# Altium project 6502.PrjPcb
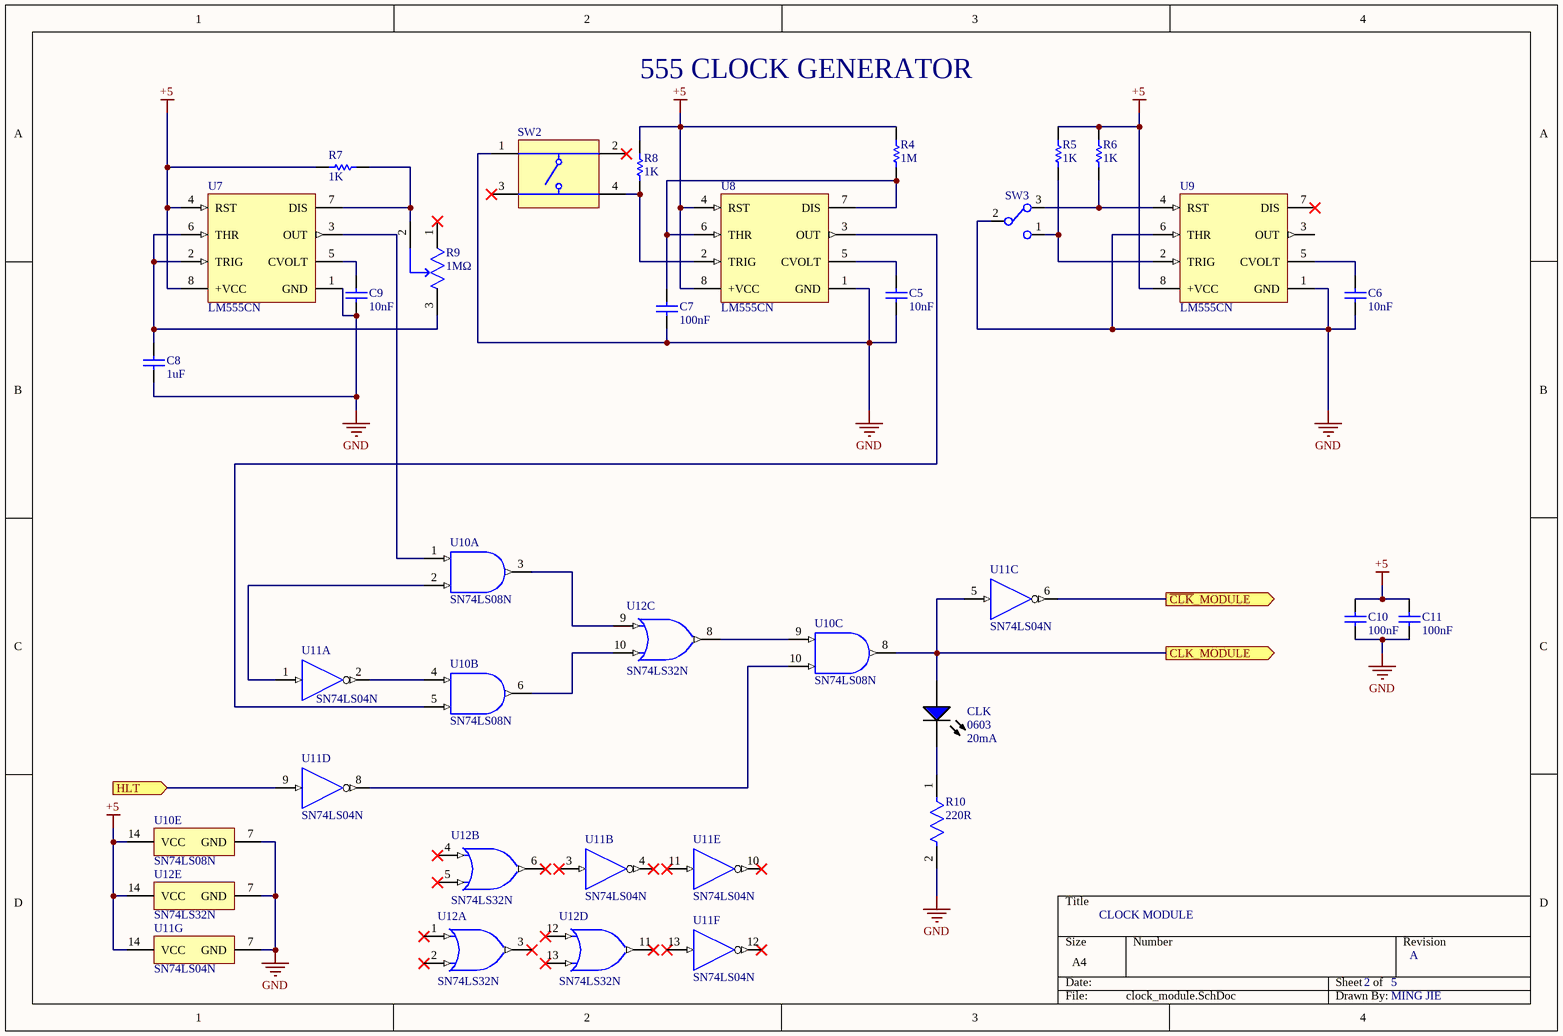
[diagram p0: clock_module.SchDoc]
3 sheets, 91 parts. Net scope: global (net labels, ports and power ports of the same name join across sheets).
Board file: 6502_carrier.PcbDoc
Sheets:
  clock_module.SchDoc
  address_LEDs.SchDoc
  ps2_interface.SchDoc

## Sheet clock_module.SchDoc
size A4; SheetNumber: 2; SheetTotal: 5

### Parts
C5  Capacitance: 10nF  [CAPC2013X70X45ML10T25]  (hidden comment: GRM216R71H103KA01D)
C6  Capacitance: 10nF  [CAPC2013X70X45ML10T25]  (hidden comment: GRM216R71H103KA01D)
C7  Capacitance: 100nF  [CAPC2013X135X45ML10T25]  (hidden comment: GRM21BR71H104KA01L)
C8  Capacitance: 1uF  [CAPC2013X70X45NL10T25]  (hidden comment: GRM216R61E105KA12D)
C9  Capacitance: 10nF  [CAPC2013X70X45ML10T25]  (hidden comment: GRM216R71H103KA01D)
C10  Capacitance: 100nF  [CAPC2013X135X45ML10T25]  (hidden comment: GRM21BR71H104KA01L)
C11  Capacitance: 100nF  [CAPC2013X135X45ML10T25]  (hidden comment: GRM21BR71H104KA01L)
CLK  Package Reference: 0603  Test Current: 20mA  [EVRL-0603-2_V]  (hidden comment: 19-217/BHC-ZL1M2RY/3T)
R4  Resistance: 1M  [RESC2013X50X30NL20T20]  (hidden comment: CRCW08051M00JNEA)
R5  Resistance: 1K  [RESC2013X50X30NL20T20]  (hidden comment: CRCW08051K00FKEA)
R6  Resistance: 1K  [RESC2013X50X30NL20T20]  (hidden comment: CRCW08051K00FKEA)
R7  Resistance: 1K  [RESC2013X50X30NL20T20]  (hidden comment: CRCW08051K00FKEA)
R8  Resistance: 1K  [RESC2013X50X30NL20T20]  (hidden comment: CRCW08051K00FKEA)
R9  Resistance: 1MΩ  [FP-3296W-MFG]  (hidden comment: 3296W-1-105LF)
R10  Resistance: 220R  [FP-CRCW0805-e3-MFG]  (hidden comment: CRCW0805220RFKEA)
SW2  K2-1102SP-C4SC-04  [TECO-FSM4JSMA_V]  (value not drawn)
SW3  SS-12D02-VG4  [5_2-54mm_SPDT]  (value not drawn)
U7  LM555CN  [N08E]
U8  LM555CN  [N08E]
U9  LM555CN  [N08E]
U10  SN74LS08N  [N0014A]  (parts A,B,C,E of 5)
U11  SN74LS04N  [N0014A]  (parts A,B,C,D,E,F,G of 7)
U12  SN74LS32N  [N0014A]  (parts A,B,C,D,E of 5)

### Ports
CLK_MODULE (out), HLT (in), ~{CLK}_MODULE (out)

### Nets
+5: C10.1 C11.1 R4.1 R5.2 R6.2 R7.1 R8.2 U7.4(RST) U7.8(+VCC) U8.4(RST) U8.8(+VCC) U9.8(+VCC) U10.14(VCC) U11.14(VCC) U12.14(VCC)
GND: C5.1 C6.1 C7.2 C8.2 C9.1 C10.2 C11.2 R10.2 SW2.1 SW3.2 U7.1(GND) U8.1(GND) U9.1(GND) U9.6(THR) U10.7(GND) U11.7(GND) U12.7(GND)
NetC5_2: C5.2 U8.5(CVOLT)
NetC6_2: C6.2 U9.5(CVOLT)
NetC7_1: C7.1 R4.2 U8.6(THR) U8.7(DIS)
NetC8_1: C8.1 R9.3(CW) U7.2(TRIG) U7.6(THR)
NetC9_2: C9.2 U7.5(CVOLT)
NetCLK_1: CLK.1(A) U10.8(3Y) U11.5(3A) ; port CLK_MODULE
NetCLK_2: CLK.2(K) R10.1
NetR5_1: R5.1 SW3.1 U9.2(TRIG)
NetR6_1: R6.1 SW3.3 U9.4(RST)
NetR7_2: R7.2 R9.2(WIPER) U7.7(DIS)
NetR8_1: R8.1 SW2.4 U8.2(TRIG)
NetU7_3: U7.3(OUT) U10.1(1A)
NetU8_3: U8.3(OUT) U10.5(2B)
NetU10_2: U10.2(1B) U11.1(1A)
NetU10_3: U10.3(1Y) U12.9(3A)
NetU10_4: U10.4(2A) U11.2(~{1Y})
NetU10_6: U10.6(2Y) U12.10(3B)
NetU10_9: U10.9(3A) U12.8(3Y)
NetU10_10: U10.10(3B) U11.8(~{4Y})
NetU11_6: U11.6(~{3Y}) ; port ~{CLK}_MODULE
NetU11_9: U11.9(4A) ; port HLT

Not connected (* = marked no-connect by the designer): R9 1(CCW)*; SW2 2* 3*; U9 3(OUT) 7(DIS)*; U11 3(2A)* 4(~{2Y})* 10(~{5Y})* 11(5A)* 12(~{6Y})* 13(6A)*; U12 1(1A)* 2(1B)* 3(1Y)* 4(2A)* 5(2B)* 6(2Y)* 11(4Y)* 12(4A)* 13(4B)*

### Notes on the sheet
- 555 CLOCK GENERATOR
- CLOCK MODULE
- 2
- 5
- A
- MING JIE

### Library data of the parts
C5 C6 C9 = CMP-2000-05013-1: Chip Capacitor, 10 nF, +/- 10%, 50 V, -55 to 125 degC, 0805 (2012 Metric), RoHS, Tape and Reel; Manufacturer: Murata; Voltage Rating DC: 50V; Temperature Coefficient / Code: +/-15%; Capacitance - pF: 10000pF; Case Height: 0.6mm; Dielectric: X7R; Case Length: 2mm; Case Width: 1.25mm; Type: GeneralPurposeMLCC; Brand: MurataElectronics; Tolerance: 10%; Product Category: MultilayerCeramicCapacitorsMLCC-SMD/SMT; Minimum Operating Temperature: -55C; Voltage Rating: 50V; Series: GRM; Packaging: Reel; Dimensions: 1.25mmWx2mmLx0.6mmH; Operating Temperature Range: -55Cto+125C; Package / Case: 0805(2012metric); Datasheet URL: https://datasheet.ciiva.com/29201/452521-da-01-en-vs-kondensator-0805-29201121.pdf; Maximum Operating Temperature: +125C; Factory Pack Quantity: 4000; Case Code - in: 0805; Case Code - mm: 2012; Manufacturer URL: http://www.murata.com/; Termination Style: SMD/SMT; Datasheet Version: Dec-10; RoHS: Details; Product: GeneralTypeMLCCs; Capacitance - nF: 10nF
C7 C10 C11 = CMP-2100-03644-1: Chip Capacitor, 0.1 uF, +/- 10%, 50 V, -55 to 125 degC, 0805 (2012 Metric), RoHS, Tape and Reel; Manufacturer: Murata; Voltage: 50V; Insulation Resistance: 10GR; Dielectric Material: Ceramic; Dielectric: X7R; Package Description: 2-Pin Surface Mount Device, Body 2 x 1.25 mm; Manufacturer URL: http://www.murata.com/; Case Code (Imperial): 0805; Datasheet URL: http://psearch.en.murata.com/capacitor/product/GRM21BR71H104KA01%23.pdf; Termination: SMD/SMT; Lead Free: LeadFree; Package Quantity: 1; Mount: SurfaceMount; REACH SVHC: Unknown; Thickness: 0.053inch; Height: 1.25mm; Case/Package: 0805; Voltage Rating: 50V; Width: 0.049inch; Case Code (Metric): 2012; Material: Ceramic; Min Operating Temperature: -55degC; RoHSCompliant: true; Datasheet Version: 42675.0; Voltage Rating (DC): 50V; Tolerance: 10%; Package Reference: 0805; Depth: 1.25mm; Length: 2mm; Max Operating Temperature: 125degC; Packaging: TapeandReel; Number of Pins: 2; Radiation Hardening: No
C8 = CMP-2007-00957-1: Manufacturer: Murata; Part Number: GRM216R61E105KA12D
CLK = CMP-2100-03577-1: Chip LED, Blue, 5 V, 25 mA, -40 to 85 degC, 2-Pin SMD (0603), RoHS, Tape and Reel; Manufacturer: Everlight Electronics; Number of LEDs: 1; Luminous Intensity: 28.5mcd; Lens Style: Rectangular; Forward Current: 25mA; Power Dissipation: 110W; Forward Voltage: 3V; Viewing Angle: 120degrees; Dominant Wavelength: 470nm; Max Operating Temperature: 85degC; Mount: SurfaceMount; Package Description: 2-Pin Surface Mount Device, Body 1.6 x 0.8 mm; Depth: 0.8mm; Packaging: TapeandReel; Length: 1.6mm; Radiation Hardening: No; Colour: Blue; Datasheet Version: Rev. 1.0, 03/2003; Min Operating Temperature: -40degC; Number of Elements: 1; Manufacturer URL: http://www.everlight.com/; Datasheet URL: https://datasheet.ciiva.com/26901/getdatasheetpartid-420616-26901324.pdf; Case/Package: SMD/SMT; Lead Free: LeadFree; RoHSCompliant: true; Number of Pins: 2
R4 = CMP-2001-03632-1: Manufacturer: Vishay Dale; Part Number: CRCW08051M00JNEA
R5-R8 = CMP-1013-00510-2: Manufacturer: Vishay Dale; Part Number: CRCW08051K00FKEA
R9 = CMP-2000-05583-2: TRIMMER 1M OHM 0.5W PC PIN TOP; Manufacturer: Bourns; Manufacturer Part Number: 3296W-1-504LF; Temperature Coefficient: 100ppm/°C; Value: 1MΩ; Tolerance: 10%; Voltage Rating: 300V; Standoff Height: 0.38mm; ComponentLink2Description: Datasheet; Package: 3296W; Series: Trimpot 3296-Sealed; Lead Free: Yes; Octopart: https://octopart.com/3296w-1-504lf-bourns-143884; Device Class L2: Resistors; Automotive: No; RoHS: TRUE; Temperature Range High: +125°C; Height: 12.05mm; Power Rating: 0.5W; Temperature Range Low: -55°C; ComponentLink2URL: https://www.bourns.com/docs/Product-Datasheets/3296.pdf; Device Class L1: Passive Components; Device Class L3: Variable Resistors and Potentiometers; Category: Res; Temperature: -55°C to +125°C; Digikey Description: TRIMMER 500K OHM 0.5W PC PIN TOP; Mouser Description: Trimmer; Cermet; Rest 500 Kilohms; PCB; 25 Turns; Pwr-Rtg 0.5W
R10 = CMP-2001-03682-2: RES Thick Film, 220Ω, 1%, 0.125W, 100ppm/°C, 0805; Max Power Dissipation: 125mW; Voltage Rating: 150V; Packaging: Tape and Reel; Termination: SMD/SMT; Height: 0.45mm; Package Quantity: 10; Width: 0.049inch; Min Operating Temperature: -55°C; Lead Free: Lead Free; Military Standard: Not; Mount: Surface Mount; Max Operating Temperature: 155°C; Voltage Rating (DC): 150V; Composition: Thick Film; Case/Package: 0805; Length: 2mm; Weight: 0.000194oz; Case Code (Metric): 2012; Number of Terminations: 2; Case Code (Imperial): 0805; Radiation Hardening: No; Tolerance: 1%; Features: Automotive AEC-Q200; Power Rating: 125mW; Depth: 1.25mm; Contact Plating: Tin; Temperature Coefficient: 100ppm/°C
SW2 = CMP-2000-05602-2: Swicth, SPST, 24 V, -35 to 85 degC, 4-Pin SMD, RoHS, Tape and Reel; Manufacturer: TE Connectivity; Switch Travel: 0.25mm; Mechanical Life: 100000Cycles; Contact Current Rating: 50mA; Operating Force: 1.57N; Actuator Material: Polyamide; Contact Resistance: 100mOhm; Voltage Rating: 24V; Illumination Type: Illuminated; Actuator Length: 0.055inch; Max Voltage Rating (DC): 12V; Case\/Package: SMD/SMT; Orientation: Straight; Datasheet URL: http://www.te.com/commerce/DocumentDelivery/DDEController?Action=showdoc&DocId=Customer+Drawing%7F2-1437565-7%7FV%7Fpdf%7FEnglish%7FENG_CD_2-1437565-7_V.pdf%7F4-1437565-2; Min Operating Temperature: -35degC; Packaging: LoosePiece; Termination: GullWing; Throw Configuration: SPST; Package Description: 4-Pin Surface Mount Device, Body 6 x 6 mm, Pitch 4.5 mm; Mounting Technology: SurfaceMount; Contact Plating: Silver; Datasheet Version: Rev. V, 02/2015; RoHSCompliant: true; Max Operating Temperature: 85degC; Length: 6mm; Voltage Rating (DC): 24V; Electrical Life: 100000Cycles; Current Rating: 50mA; Package Quantity: 750; Mount: SurfaceMount; Package Reference: FSM4JSMA; Manufacturer URL: http://www.te.com/; Width: 6mm; REACH SVHC: Unknown; Contact Material: CopperAlloy
SW3 = SS-12D02-VG4: SPDT, Korean Hroparts Elec SS-12D02-VG4
U7-U9 = CMP-0056-00017-2: Timer, 8-pin MDIP; Manufacturer: National Semiconductor; CompType: Analog IC; PackageTopMarking: NSUZXYTTE#*LM*555CN; PowerWise: N; PackageReference: N08E; ComponentLink1Description: LM555 Datasheet; ComponentLink3URL: http://www.national.com/packaging/folders/n08e.html; ComponentLink1URL: http://www.national.com/ds/LM/LM555.pdf; ComponentLink2URL: http://www.national.com/pf/LM/LM555.html; PackageDescription: MDIP, .365 x .250 x .130in, 8 Lead, .100in Pitch; DatasheetVersion: Jul-2006; RevisionNote: Component URLs added; Code_JEDEC: MS-001-BA; PinCount: 8; ComponentLink3Description: N08E Package Page; PackageVersion: revG, May-2006; ComponentLink2Description: LM555 Web Page; RoHS: N
U10 = CMP-0777-00259-3: Quadruple 2-Input Positive-AND Gates, N0014A, TUBE; Manufacturer: Texas Instruments; VCC(Max)(V): 5.25; ICC @ Nom Voltage(Max)(mA): 0.021; VCC(Min)(V): 4.75; tpd @ Nom Voltage(Max)(ns): 25; Rating: Catalog; Output Type: TTL; Bits(#): 4; Schmitt Trigger: No; Voltage(Nom)(V): 5; Technology Family: LS; F @ Nom Voltage(Max)(Mhz): 35; Output Drive (IOL/IOH)(Max)(mA): -0.8/16; PackageReference: N0014A; DatasheetVersion: SDLS033; Input Type: TTL; Operating Temperature Range(C): 0 to 70; Generic Part Number: SN74LS08
U11 = CMP-1615-00911-2: Hex inverters, N0014A, TUBE; Manufacturer: Texas Instruments; Output Drive (IOL/IOH)(Max)(mA): -0.4/8; Schmitt Trigger: No; F @ Nom Voltage(Max)(Mhz): 35; Voltage(Nom)(V): 5; Technology Family: LS; Input Type: TTL; Output Type: CMOS; Bits(#): 6; VCC(Max)(V): 5.25; ICC @ Nom Voltage(Max)(mA): 0.033; Rating: Catalog; VCC(Min)(V): 4.75; tpd @ Nom Voltage(Max)(ns): 22; Operating Temperature Range(C): 0 to 70; DatasheetVersion: SDLS029C; Generic Part Number: SN74LS04; Code_JEDEC: MS-001; PackageReference: N0014A
U12 = CMP-1573-00145-3: Quad 2-input positive-OR gates, N0014A, TUBE; Manufacturer: Texas Instruments; tpd @ Nom Voltage(Max)(ns): 22; Output Drive (IOL/IOH)(Max)(mA): 0.8/-16; Input Type: TTL; VCC(Min)(V): 4.75; F @ Nom Voltage(Max)(Mhz): 35; Voltage(Nom)(V): 5; ICC @ Nom Voltage(Max)(mA): 0.038; VCC(Max)(V): 5.25; Rating: Catalog; Bits(#): 4; Generic Part Number: SN74LS32; DatasheetVersion: SDLS100; Operating Temperature Range(C): 0 to 70; Output Type: TTL; Code_JEDEC: MS-001; PackageVersion: http://www.ti.com/lit/ml/mpdi002c/mpdi002c.pdf; PackageReference: N0014A

## Sheet address_LEDs.SchDoc
size A4; SheetNumber: 3; SheetTotal: 5
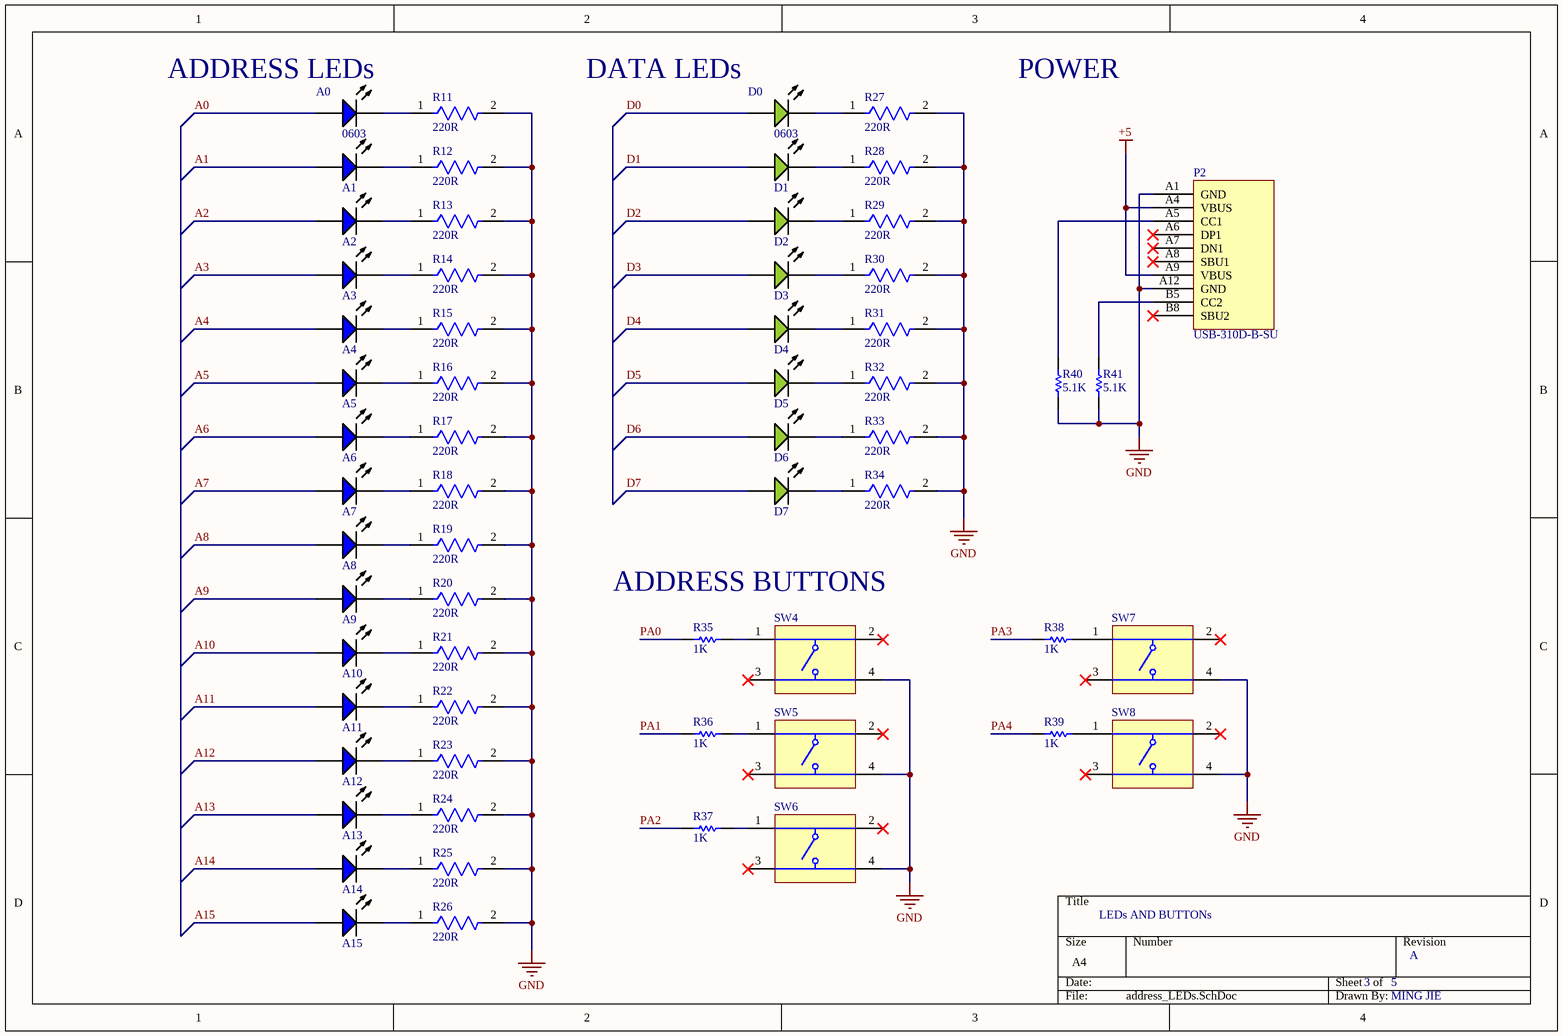
[diagram p1: address_LEDs.SchDoc]

### Parts
A0  Package Reference: 0603  [EVRL-0603-2_V]  (hidden comment: 19-217/BHC-ZL1M2RY/3T)
A1  19-217/BHC-ZL1M2RY/3T  [EVRL-0603-2_V]  (value not drawn)
A2  19-217/BHC-ZL1M2RY/3T  [EVRL-0603-2_V]  (value not drawn)
A3  19-217/BHC-ZL1M2RY/3T  [EVRL-0603-2_V]  (value not drawn)
A4  19-217/BHC-ZL1M2RY/3T  [EVRL-0603-2_V]  (value not drawn)
A5  19-217/BHC-ZL1M2RY/3T  [EVRL-0603-2_V]  (value not drawn)
A6  19-217/BHC-ZL1M2RY/3T  [EVRL-0603-2_V]  (value not drawn)
A7  19-217/BHC-ZL1M2RY/3T  [EVRL-0603-2_V]  (value not drawn)
A8  19-217/BHC-ZL1M2RY/3T  [EVRL-0603-2_V]  (value not drawn)
A9  19-217/BHC-ZL1M2RY/3T  [EVRL-0603-2_V]  (value not drawn)
A10  19-217/BHC-ZL1M2RY/3T  [EVRL-0603-2_V]  (value not drawn)
A11  19-217/BHC-ZL1M2RY/3T  [EVRL-0603-2_V]  (value not drawn)
A12  19-217/BHC-ZL1M2RY/3T  [EVRL-0603-2_V]  (value not drawn)
A13  19-217/BHC-ZL1M2RY/3T  [EVRL-0603-2_V]  (value not drawn)
A14  19-217/BHC-ZL1M2RY/3T  [EVRL-0603-2_V]  (value not drawn)
A15  19-217/BHC-ZL1M2RY/3T  [EVRL-0603-2_V]  (value not drawn)
D0  Package Reference: 0603  [EVRL-0603-2_V]  (hidden comment: 19-217/GHC-YR1S2/3T)
D1  19-217/GHC-YR1S2/3T  [EVRL-0603-2_V]  (value not drawn)
D2  19-217/GHC-YR1S2/3T  [EVRL-0603-2_V]  (value not drawn)
D3  19-217/GHC-YR1S2/3T  [EVRL-0603-2_V]  (value not drawn)
D4  19-217/GHC-YR1S2/3T  [EVRL-0603-2_V]  (value not drawn)
D5  19-217/GHC-YR1S2/3T  [EVRL-0603-2_V]  (value not drawn)
D6  19-217/GHC-YR1S2/3T  [EVRL-0603-2_V]  (value not drawn)
D7  19-217/GHC-YR1S2/3T  [EVRL-0603-2_V]  (value not drawn)
P2  USB-310D-B-SU  [USB-C-THT]
R11  Resistance: 220R  [FP-CRCW0805-e3-MFG]  (hidden comment: CRCW0805220RFKEA)
R12  Resistance: 220R  [FP-CRCW0805-e3-MFG]  (hidden comment: CRCW0805220RFKEA)
R13  Resistance: 220R  [FP-CRCW0805-e3-MFG]  (hidden comment: CRCW0805220RFKEA)
R14  Resistance: 220R  [FP-CRCW0805-e3-MFG]  (hidden comment: CRCW0805220RFKEA)
R15  Resistance: 220R  [FP-CRCW0805-e3-MFG]  (hidden comment: CRCW0805220RFKEA)
R16  Resistance: 220R  [FP-CRCW0805-e3-MFG]  (hidden comment: CRCW0805220RFKEA)
R17  Resistance: 220R  [FP-CRCW0805-e3-MFG]  (hidden comment: CRCW0805220RFKEA)
R18  Resistance: 220R  [FP-CRCW0805-e3-MFG]  (hidden comment: CRCW0805220RFKEA)
R19  Resistance: 220R  [FP-CRCW0805-e3-MFG]  (hidden comment: CRCW0805220RFKEA)
R20  Resistance: 220R  [FP-CRCW0805-e3-MFG]  (hidden comment: CRCW0805220RFKEA)
R21  Resistance: 220R  [FP-CRCW0805-e3-MFG]  (hidden comment: CRCW0805220RFKEA)
R22  Resistance: 220R  [FP-CRCW0805-e3-MFG]  (hidden comment: CRCW0805220RFKEA)
R23  Resistance: 220R  [FP-CRCW0805-e3-MFG]  (hidden comment: CRCW0805220RFKEA)
R24  Resistance: 220R  [FP-CRCW0805-e3-MFG]  (hidden comment: CRCW0805220RFKEA)
R25  Resistance: 220R  [FP-CRCW0805-e3-MFG]  (hidden comment: CRCW0805220RFKEA)
R26  Resistance: 220R  [FP-CRCW0805-e3-MFG]  (hidden comment: CRCW0805220RFKEA)
R27  Resistance: 220R  [FP-CRCW0805-e3-MFG]  (hidden comment: CRCW0805220RFKEA)
R28  Resistance: 220R  [FP-CRCW0805-e3-MFG]  (hidden comment: CRCW0805220RFKEA)
R29  Resistance: 220R  [FP-CRCW0805-e3-MFG]  (hidden comment: CRCW0805220RFKEA)
R30  Resistance: 220R  [FP-CRCW0805-e3-MFG]  (hidden comment: CRCW0805220RFKEA)
R31  Resistance: 220R  [FP-CRCW0805-e3-MFG]  (hidden comment: CRCW0805220RFKEA)
R32  Resistance: 220R  [FP-CRCW0805-e3-MFG]  (hidden comment: CRCW0805220RFKEA)
R33  Resistance: 220R  [FP-CRCW0805-e3-MFG]  (hidden comment: CRCW0805220RFKEA)
R34  Resistance: 220R  [FP-CRCW0805-e3-MFG]  (hidden comment: CRCW0805220RFKEA)
R35  Resistance: 1K  [RESC2013X50X30NL20T20]  (hidden comment: CRCW08051K00FKEA)
R36  Resistance: 1K  [RESC2013X50X30NL20T20]  (hidden comment: CRCW08051K00FKEA)
R37  Resistance: 1K  [RESC2013X50X30NL20T20]  (hidden comment: CRCW08051K00FKEA)
R38  Resistance: 1K  [RESC2013X50X30NL20T20]  (hidden comment: CRCW08051K00FKEA)
R39  Resistance: 1K  [RESC2013X50X30NL20T20]  (hidden comment: CRCW08051K00FKEA)
R40  Resistance: 5.1K  [RESC2013X50X30NL20T20]  (hidden comment: 0805W8F5101T5E)
R41  Resistance: 5.1K  [RESC2013X50X30NL20T20]  (hidden comment: 0805W8F5101T5E)
SW4  K2-1102SP-C4SC-04  [TECO-FSM4JSMA_V]  (value not drawn)
SW5  K2-1102SP-C4SC-04  [TECO-FSM4JSMA_V]  (value not drawn)
SW6  K2-1102SP-C4SC-04  [TECO-FSM4JSMA_V]  (value not drawn)
SW7  K2-1102SP-C4SC-04  [TECO-FSM4JSMA_V]  (value not drawn)
SW8  K2-1102SP-C4SC-04  [TECO-FSM4JSMA_V]  (value not drawn)

### Nets
+5: P2.A4(VBUS) P2.A9(VBUS)
GND: P2.A1(GND) P2.A12(GND) R11.2 R12.2 R13.2 R14.2 R15.2 R16.2 R17.2 R18.2 R19.2 R20.2 R21.2 R22.2 R23.2 R24.2 R25.2 R26.2 R27.2 R28.2 R29.2 R30.2 R31.2 R32.2 R33.2 R34.2 R40.1 R41.1 SW4.4 SW5.4 SW6.4 SW7.4 SW8.4
A0: A0.1(A)
A1: A1.1(A)
A2: A2.1(A)
A3: A3.1(A)
A4: A4.1(A)
A5: A5.1(A)
A6: A6.1(A)
A7: A7.1(A)
A8: A8.1(A)
A9: A9.1(A)
A10: A10.1(A)
A11: A11.1(A)
A12: A12.1(A)
A13: A13.1(A)
A14: A14.1(A)
A15: A15.1(A)
D0: D0.1(A)
D1: D1.1(A)
D2: D2.1(A)
D3: D3.1(A)
D4: D4.1(A)
D5: D5.1(A)
D6: D6.1(A)
D7: D7.1(A)
PA0: R35.1
PA1: R36.1
PA2: R37.1
PA3: R38.1
PA4: R39.1
NetA0_2: A0.2(K) R11.1
NetA1_2: A1.2(K) R12.1
NetA2_2: A2.2(K) R13.1
NetA3_2: A3.2(K) R14.1
NetA4_2: A4.2(K) R15.1
NetA5_2: A5.2(K) R16.1
NetA6_2: A6.2(K) R17.1
NetA7_2: A7.2(K) R18.1
NetA8_2: A8.2(K) R19.1
NetA9_2: A9.2(K) R20.1
NetA10_2: A10.2(K) R21.1
NetA11_2: A11.2(K) R22.1
NetA12_2: A12.2(K) R23.1
NetA13_2: A13.2(K) R24.1
NetA14_2: A14.2(K) R25.1
NetA15_2: A15.2(K) R26.1
NetD0_2: D0.2(K) R27.1
NetD1_2: D1.2(K) R28.1
NetD2_2: D2.2(K) R29.1
NetD3_2: D3.2(K) R30.1
NetD4_2: D4.2(K) R31.1
NetD5_2: D5.2(K) R32.1
NetD6_2: D6.2(K) R33.1
NetD7_2: D7.2(K) R34.1
NetP2_A5: P2.A5(CC1) R40.2
NetP2_B5: P2.B5(CC2) R41.2
NetR35_2: R35.2 SW4.1
NetR36_2: R36.2 SW5.1
NetR37_2: R37.2 SW6.1
NetR38_2: R38.2 SW7.1
NetR39_2: R39.2 SW8.1

Not connected (* = marked no-connect by the designer): P2 A6(DP1)* A7(DN1)* A8(SBU1)* B8(SBU2)*; SW4 2* 3*; SW5 2* 3*; SW6 2* 3*; SW7 2* 3*; SW8 2* 3*

### Notes on the sheet
- (near A0) ADDRESS LEDs
- DATA LEDs
- POWER
- ADDRESS BUTTONS
- LEDs AND BUTTONs
- 3
- 5
- A
- MING JIE

### Library data of the parts
A0-A15 = CMP-2100-03577-1: Chip LED, Blue, 5 V, 25 mA, -40 to 85 degC, 2-Pin SMD (0603), RoHS, Tape and Reel; Manufacturer: Everlight Electronics; Test Current: 20mA; Number of LEDs: 1; Luminous Intensity: 28.5mcd; Lens Style: Rectangular; Forward Current: 25mA; Power Dissipation: 110W; Forward Voltage: 3V; Viewing Angle: 120degrees; Dominant Wavelength: 470nm; Max Operating Temperature: 85degC; Mount: SurfaceMount; Package Description: 2-Pin Surface Mount Device, Body 1.6 x 0.8 mm; Depth: 0.8mm; Packaging: TapeandReel; Length: 1.6mm; Radiation Hardening: No; Colour: Blue; Datasheet Version: Rev. 1.0, 03/2003; Min Operating Temperature: -40degC; Number of Elements: 1; Manufacturer URL: http://www.everlight.com/; Datasheet URL: https://datasheet.ciiva.com/26901/getdatasheetpartid-420616-26901324.pdf; Case/Package: SMD/SMT; Lead Free: LeadFree; RoHSCompliant: true; Number of Pins: 2
  A1-A15: Package Reference: 0603
D0-D7 = CMP-2100-03580-1: Green 520~535nm 0603 Light Emitting Diodes (LED) RoHS; Manufacturer: Everlight Electronics; Lens Style: Rectangular; Forward Voltage: 2V; Number of LEDs: 1; Viewing Angle: 120degrees; Colour: Green; RoHSCompliant: true; Datasheet URL: https://datasheet.ciiva.com/48679/19-217-g7c-an1p2-3t-48679179.pdf; Manufacturer URL: http://www.everlight.com/; Package Description: 2-Pin Surface Mount Device, Body 1.6 x 0.8 mm; Datasheet Version: Rev. 1, 04/2006; Mount: SurfaceMount; Lead Free: LeadFree; Number of Pins: 2
  D1-D7: Package Reference: 0603
P2 = USB-310D-B-SU: USB Type C Receptacle
R11-R34 = CMP-2001-03682-2: as R10 on sheet clock_module; Packaging: Tape and Reel; Termination: SMD/SMT; Height: 0.45mm; Package Quantity: 10; Width: 0.049inch; Min Operating Temperature: -55°C; Lead Free: Lead Free; Military Standard: Not; Mount: Surface Mount; Max Operating Temperature: 155°C; Voltage Rating (DC): 150V; Composition: Thick Film; Case/Package: 0805; Length: 2mm; Weight: 0.000194oz; Case Code (Metric): 2012; Number of Terminations: 2; Case Code (Imperial): 0805; Radiation Hardening: No; Tolerance: 1%; Features: Automotive AEC-Q200; Power Rating: 125mW; Depth: 1.25mm; Contact Plating: Tin; Temperature Coefficient: 100ppm/°C
R35-R39 = CMP-1013-00510-2: Manufacturer: Vishay Dale; Part Number: CRCW08051K00FKEA
R40 R41 = CMP-1013-00510-2: 5.1kΩ ±1% 0.125W ±100ppm/℃ 0805 Chip Resistor - Surface Mount RoHS; Manufacturer: UniOhm; Part Number: 0805W8F5101T5E
SW4-SW8 = CMP-2000-05602-2: as SW2 on sheet clock_module; Orientation: Straight; Datasheet URL: http://www.te.com/commerce/DocumentDelivery/DDEController?Action=showdoc&DocId=Customer+Drawing%7F2-1437565-7%7FV%7Fpdf%7FEnglish%7FENG_CD_2-1437565-7_V.pdf%7F4-1437565-2; Min Operating Temperature: -35degC; Packaging: LoosePiece; Termination: GullWing; Throw Configuration: SPST; Package Description: 4-Pin Surface Mount Device, Body 6 x 6 mm, Pitch 4.5 mm; Mounting Technology: SurfaceMount; Contact Plating: Silver; Datasheet Version: Rev. V, 02/2015; RoHSCompliant: true; Max Operating Temperature: 85degC; Length: 6mm; Voltage Rating (DC): 24V; Electrical Life: 100000Cycles; Current Rating: 50mA; Package Quantity: 750; Mount: SurfaceMount; Package Reference: FSM4JSMA; Manufacturer URL: http://www.te.com/; Width: 6mm; REACH SVHC: Unknown; Contact Material: CopperAlloy

## Sheet ps2_interface.SchDoc
size A4; SheetNumber: 5; SheetTotal: 5
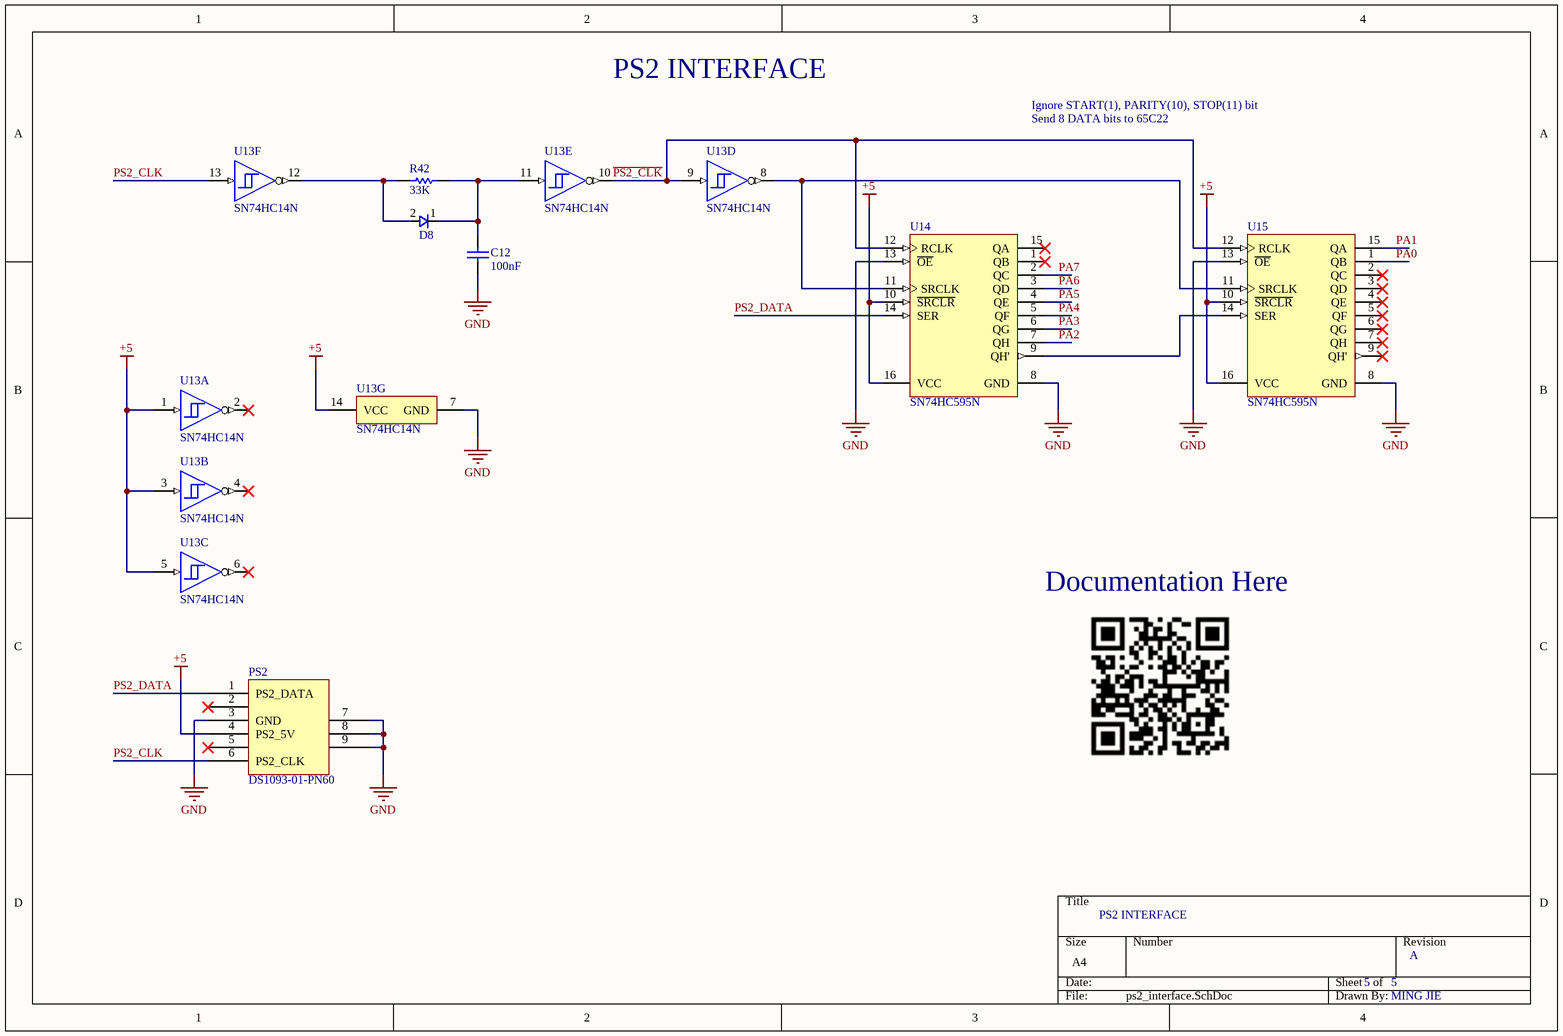
[diagram p2: ps2_interface.SchDoc]

### Parts
C12  Capacitance: 100nF  [CAPC2013X135X45ML10T25]  (hidden comment: GRM21BR71H104KA01L)
D8  Diode, General Purpose  [DO-214AC/SMA]  (value not drawn)
PS2  DS1093-01-PN60  [PS2_PORT]
R42  Resistance: 33K  [RESC2013X50X30NL20T20]  (hidden comment: 0805W8F3302T5E)
U13  SN74HC14N  [N0014A]  (parts A,B,C,D,E,F,G of 7)
U14  SN74HC595N  [N0016A]
U15  SN74HC595N  [N0016A]

### Nets
+5: PS2.4(PS2_5V) U13.1(1A) U13.3(2A) U13.5(3A) U13.14(VCC) U14.10(~{SRCLR}) U14.16(VCC) U15.10(~{SRCLR}) U15.16(VCC)
GND: C12.2 PS2.3(GND) PS2.7 PS2.8 PS2.9 U13.7(GND) U14.8(GND) U14.13(~{OE}) U15.8(GND) U15.13(~{OE})
~{PS2_CLK}: U13.9(4A) U13.10(~{5Y}) U14.12(RCLK) U15.12(RCLK)
PA0: U15.1(QB)
PA1: U15.15(QA)
PA2: U14.7(QH)
PA3: U14.6(QG)
PA4: U14.5(QF)
PA5: U14.4(QE)
PA6: U14.3(QD)
PA7: U14.2(QC)
PS2_CLK: PS2.6(PS2_CLK) U13.13(6A)
PS2_DATA: PS2.1(PS2_DATA) U14.14(SER)
NetC12_1: C12.1 D8.1 R42.2 U13.11(5A)
NetD8_2: D8.2 R42.1 U13.12(~{6Y})
NetU13_8: U13.8(~{4Y}) U14.11(SRCLK) U15.11(SRCLK)
NetU14_9: U14.9(QH') U15.14(SER)

Not connected (* = marked no-connect by the designer): PS2 2* 5*; U13 2(~{1Y})* 4(~{2Y})* 6(~{3Y})*; U14 1(QB)* 15(QA)*; U15 2(QC)* 3(QD)* 4(QE)* 5(QF)* 6(QG)* 7(QH)* 9(QH')*

### Notes on the sheet
- PS2 INTERFACE
- Ignore START(1), PARITY(10), STOP(11) bit
- Send 8 DATA bits to 65C22
- Documentation Here
- 5
- A
- MING JIE

### Library data of the parts
C12 = CMP-2100-03644-1: as C7 on sheet clock_module; Package Description: 2-Pin Surface Mount Device, Body 2 x 1.25 mm; Manufacturer URL: http://www.murata.com/; Case Code (Imperial): 0805; Datasheet URL: http://psearch.en.murata.com/capacitor/product/GRM21BR71H104KA01%23.pdf; Termination: SMD/SMT; Lead Free: LeadFree; Package Quantity: 1; Mount: SurfaceMount; REACH SVHC: Unknown; Thickness: 0.053inch; Height: 1.25mm; Case/Package: 0805; Voltage Rating: 50V; Width: 0.049inch; Case Code (Metric): 2012; Material: Ceramic; Min Operating Temperature: -55degC; RoHSCompliant: true; Datasheet Version: 42675.0; Voltage Rating (DC): 50V; Tolerance: 10%; Package Reference: 0805; Depth: 1.25mm; Length: 2mm; Max Operating Temperature: 125degC; Packaging: TapeandReel; Number of Pins: 2; Radiation Hardening: No
D8 = C95872: General Purpose Diode, SMT, DO-214
PS2 = PS2_CONN: PS2 Port
R42 = CMP-1013-00510-2: 33K, 0805 Chip Resistor, UniOhm; Part Number: 0805W8F3302T5E; Manufacturer: Uni Ohm
U13 = CMP-1615-00889-3: Hex Schmitt-Trigger Inverters, N0014A, TUBE; Manufacturer: Texas Instruments; Input Type: CMOS; Voltage(Nom)(V): 5; VCC(Min)(V): 2; tpd @ Nom Voltage(Max)(ns): 31; Technology Family: HC; VCC(Max)(V): 6; F @ Nom Voltage(Max)(Mhz): 20; Output Drive (IOL/IOH)(Max)(mA): -4/4; Rating: Catalog; Schmitt Trigger: Yes; ICC @ Nom Voltage(Max)(mA): 0.02; PackageReference: N0014A; Code_JEDEC: MS-001; Operating Temperature Range(C): -40 to 85; Generic Part Number: SN74HC14; Bits(#): 6; DatasheetVersion: SCLS085G; Output Type: CMOS
U14 U15 = CMP-0780-00137-3: 8-Bit Shift Registers With 3-State Output Registers, N0016A, TUBE; Manufacturer: Texas Instruments; F @ Nom Voltage(Max)(Mhz): 28; Input Type: CMOS; Bits: 8; VCC(Min)(V): 2; 3-State Output: Yes; ICC @ Nom Voltage(Max)(mA): 0.08; VCC(Max)(V): 6; tpd @ Nom Voltage(Max)(ns): 34; Rating: Military; Technology Family: HC; Output Drive (IOL/IOH)(Max)(mA): 7.8/-7.8; Code_JEDEC: MS-001; Output Type: CMOS; Operating Temperature Range(C): -40 to 85; Voltage(Nom)(V): 6; Generic Part Number: SN74HC595; DatasheetVersion: SCLS041H; PackageReference: N0016A; PackageVersion: http://www.ti.com/lit/ml/mpdi002c/mpdi002c.pdf

## Nets that join several sheets
+5: clock_module (15 pins), address_LEDs (P2.A4 P2.A9), ps2_interface (9 pins)
GND: clock_module (17 pins), address_LEDs (33 pins), ps2_interface (10 pins)
PA0: address_LEDs (R35.1), ps2_interface (U15.1)
PA1: address_LEDs (R36.1), ps2_interface (U15.15)
PA2: address_LEDs (R37.1), ps2_interface (U14.7)
PA3: address_LEDs (R38.1), ps2_interface (U14.6)
PA4: address_LEDs (R39.1), ps2_interface (U14.5)